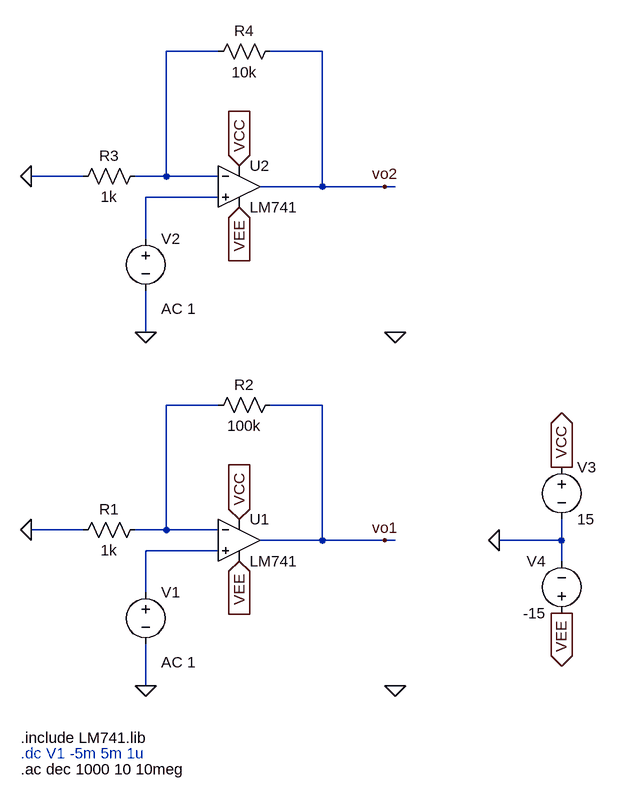
[diagram p0: schematic Lab4prelabp3.asc]
Lab4prelabp3.asc, the LTspice schematic file:
Version 4
SHEET 1 984 856
WIRE 32 -688 -48 -688
WIRE 192 -688 112 -688
WIRE -176 -496 -256 -496
WIRE -48 -496 -48 -688
WIRE -48 -496 -96 -496
WIRE 32 -496 -48 -496
WIRE 192 -480 192 -688
WIRE 192 -480 96 -480
WIRE 288 -480 192 -480
WIRE 304 -480 288 -480
WIRE 32 -464 -80 -464
WIRE -80 -400 -80 -464
WIRE -80 -256 -80 -320
WIRE 32 -144 -48 -144
WIRE 192 -144 112 -144
WIRE -176 48 -256 48
WIRE -48 48 -48 -144
WIRE -48 48 -96 48
WIRE 32 48 -48 48
WIRE 192 64 192 -144
WIRE 192 64 96 64
WIRE 288 64 192 64
WIRE 304 64 288 64
WIRE 560 64 560 32
WIRE 560 64 464 64
WIRE 32 80 -80 80
WIRE 560 96 560 64
WIRE -80 144 -80 80
WIRE -80 288 -80 224
FLAG 64 96 VEE
IOPIN 64 96 In
FLAG 64 32 VCC
IOPIN 64 32 In
FLAG 464 64 0
FLAG 560 -48 VCC
IOPIN 560 -48 Out
FLAG 560 176 VEE
IOPIN 560 176 Out
FLAG -256 48 0
FLAG 304 288 0
FLAG -80 288 0
FLAG 64 -448 VEE
IOPIN 64 -448 In
FLAG 64 -512 VCC
IOPIN 64 -512 In
FLAG -256 -496 0
FLAG 304 -256 0
FLAG -80 -256 0
FLAG 288 64 vo1
FLAG 288 -480 vo2
SYMBOL voltage 560 -64 R0
SYMATTR InstName V3
SYMATTR Value 15
SYMBOL voltage 560 192 R180
WINDOW 0 24 96 Left 2
WINDOW 3 24 16 Left 2
SYMATTR InstName V4
SYMATTR Value -15
SYMBOL OpAmps\\opamp2 64 0 R0
SYMATTR InstName U1
SYMATTR Value LM741
SYMBOL voltage -80 128 R0
WINDOW 123 24 124 Left 2
WINDOW 39 0 0 Left 0
SYMATTR Value2 AC 1
SYMATTR InstName V1
SYMATTR Value ""
SYMBOL res -80 32 R90
WINDOW 0 0 56 VBottom 2
WINDOW 3 32 56 VTop 2
SYMATTR InstName R1
SYMATTR Value 1k
SYMBOL res 128 -160 R90
WINDOW 0 0 56 VBottom 2
WINDOW 3 32 56 VTop 2
SYMATTR InstName R2
SYMATTR Value 100k
SYMBOL OpAmps\\opamp2 64 -544 R0
SYMATTR InstName U2
SYMATTR Value LM741
SYMBOL voltage -80 -416 R0
WINDOW 123 24 124 Left 2
WINDOW 39 0 0 Left 0
SYMATTR Value2 AC 1
SYMATTR InstName V2
SYMATTR Value ""
SYMBOL res -80 -512 R90
WINDOW 0 0 56 VBottom 2
WINDOW 3 32 56 VTop 2
SYMATTR InstName R3
SYMATTR Value 1k
SYMBOL res 128 -704 R90
WINDOW 0 0 56 VBottom 2
WINDOW 3 32 56 VTop 2
SYMATTR InstName R4
SYMATTR Value 10k
TEXT -272 368 Left 2 !.include LM741.lib
TEXT -272 392 Left 2 ;.dc V1 -5m 5m 1u
TEXT -272 416 Left 2 !.ac dec 1000 10 10meg

The netlist it stands for:
* Lab4prelabp3.asc
V3 VCC 0 15
V4 VEE 0 -15
XU1 N004 N003 VCC VEE vo1 LM741  ; pins In+ In- V+ V- OUT
V1 N004 0 AC 1
R1 N003 0 1k
R2 vo1 N003 100k
XU2 N002 N001 VCC VEE vo2 LM741  ; pins In+ In- V+ V- OUT
V2 N002 0 AC 1
R3 N001 0 1k
R4 vo2 N001 10k
.include LM741.lib
* .dc V1 -5m 5m 1u
.ac dec 1000 10 10meg
.backanno
.end